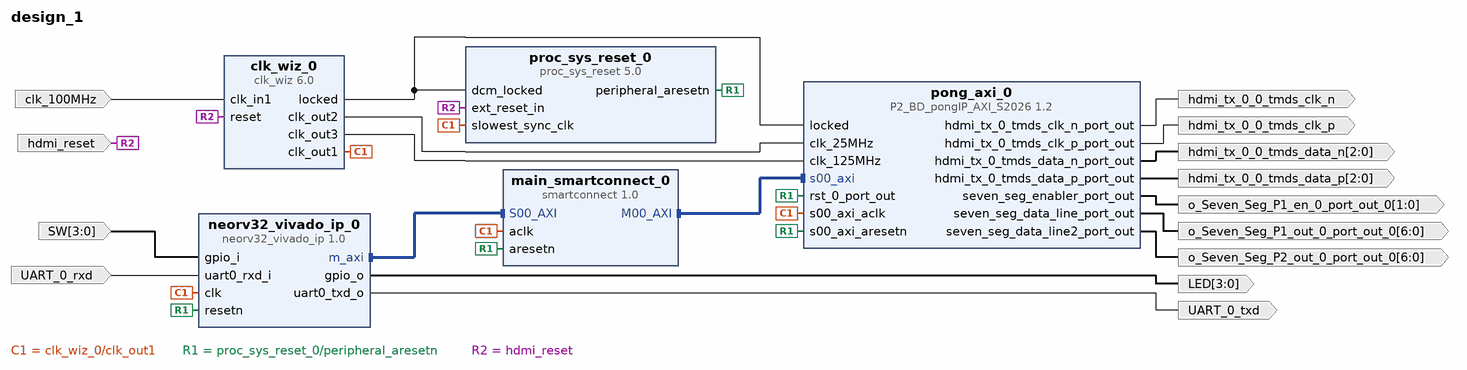
[diagram p0: block diagram of the top level]
# Vivado block design design_1, xc7s50csga324-1, Vivado 2025.1
create_bd_design design_1

create_bd_port -dir I -type clk clk_100MHz
set_property -dict {CONFIG.FREQ_HZ 100000000} [get_bd_ports clk_100MHz]
create_bd_port -dir I -type rst hdmi_reset
set_property -dict {CONFIG.POLARITY ACTIVE_HIGH} [get_bd_ports hdmi_reset]
create_bd_port -dir I UART_0_rxd
create_bd_port -dir O -type data UART_0_txd
create_bd_port -dir I -from 3 -to 0 SW
create_bd_port -dir O -from 3 -to 0 LED
create_bd_port -dir O -from 1 -to 0 o_Seven_Seg_P1_en_0_port_out_0
create_bd_port -dir O -from 6 -to 0 o_Seven_Seg_P1_out_0_port_out_0
create_bd_port -dir O -from 6 -to 0 -type data o_Seven_Seg_P2_out_0_port_out_0
create_bd_port -dir O -from 2 -to 0 -type data hdmi_tx_0_0_tmds_data_p
create_bd_port -dir O -from 2 -to 0 -type data hdmi_tx_0_0_tmds_data_n
create_bd_port -dir O -type clk hdmi_tx_0_0_tmds_clk_p
create_bd_port -dir O -type clk hdmi_tx_0_0_tmds_clk_n

create_bd_cell -type ip -vlnv xilinx.com:ip:clk_wiz:6.0 clk_wiz_0
set_property -dict [list \
  CONFIG.CLKOUT1_JITTER 130.958 \
  CONFIG.CLKOUT1_PHASE_ERROR 98.575 \
  CONFIG.CLKOUT1_REQUESTED_OUT_FREQ 100.000 \
  CONFIG.CLKOUT2_JITTER 175.402 \
  CONFIG.CLKOUT2_PHASE_ERROR 98.575 \
  CONFIG.CLKOUT2_REQUESTED_OUT_FREQ 25.000 \
  CONFIG.CLKOUT2_USED true \
  CONFIG.CLKOUT3_JITTER 125.247 \
  CONFIG.CLKOUT3_PHASE_ERROR 98.575 \
  CONFIG.CLKOUT3_REQUESTED_OUT_FREQ 125.000 \
  CONFIG.CLKOUT3_USED true \
  CONFIG.MMCM_CLKFBOUT_MULT_F 10.000 \
  CONFIG.MMCM_CLKOUT0_DIVIDE_F 10.000 \
  CONFIG.MMCM_CLKOUT1_DIVIDE 40 \
  CONFIG.MMCM_CLKOUT2_DIVIDE 8 \
  CONFIG.NUM_OUT_CLKS 3 \
] [get_bd_cells clk_wiz_0]
create_bd_cell -type ip -vlnv xilinx.com:ip:proc_sys_reset:5.0 proc_sys_reset_0
create_bd_cell -type ip -vlnv xilinx.com:ip:smartconnect:1.0 main_smartconnect_0
create_bd_cell -type ip -vlnv NEORV32:user:neorv32_vivado_ip:1.0 neorv32_vivado_ip_0
set_property -dict [list \
  CONFIG.BOOT_MODE_SELECT 2 \
  CONFIG.DMEM_EN true \
  CONFIG.IMEM_EN true \
  CONFIG.IO_GPIO_EN true \
  CONFIG.IO_GPIO_IN_NUM 4 \
  CONFIG.IO_GPIO_OUT_NUM 4 \
  CONFIG.IO_UART0_EN true \
  CONFIG.XBUS_EN true \
] [get_bd_cells neorv32_vivado_ip_0]
create_bd_cell -type ip -vlnv xilinx.com:user:P2_BD_pongIP_AXI_S2026:1.2 pong_axi_0

# ---- connections ----

connect_bd_intf_net [get_bd_intf_pins main_smartconnect_0/M00_AXI] [get_bd_intf_pins pong_axi_0/s00_axi]
connect_bd_intf_net [get_bd_intf_pins neorv32_vivado_ip_0/m_axi] [get_bd_intf_pins main_smartconnect_0/S00_AXI]
connect_bd_net [get_bd_ports clk_100MHz] [get_bd_pins clk_wiz_0/clk_in1]
connect_bd_net [get_bd_pins clk_wiz_0/clk_out1] \
  [get_bd_pins proc_sys_reset_0/slowest_sync_clk] [get_bd_pins main_smartconnect_0/aclk] \
  [get_bd_pins pong_axi_0/s00_axi_aclk] [get_bd_pins neorv32_vivado_ip_0/clk]
connect_bd_net [get_bd_pins clk_wiz_0/clk_out2] [get_bd_pins pong_axi_0/clk_25MHz]
connect_bd_net [get_bd_pins clk_wiz_0/clk_out3] [get_bd_pins pong_axi_0/clk_125MHz]
connect_bd_net [get_bd_pins clk_wiz_0/locked] [get_bd_pins proc_sys_reset_0/dcm_locked] [get_bd_pins pong_axi_0/locked]
connect_bd_net -net gpio_io_i_0_1 [get_bd_ports SW] [get_bd_pins neorv32_vivado_ip_0/gpio_i]
connect_bd_net [get_bd_pins neorv32_vivado_ip_0/gpio_o] [get_bd_ports LED]
connect_bd_net [get_bd_pins neorv32_vivado_ip_0/uart0_txd_o] [get_bd_ports UART_0_txd]
connect_bd_net [get_bd_pins pong_axi_0/hdmi_tx_0_tmds_clk_n_port_out] [get_bd_ports hdmi_tx_0_0_tmds_clk_n]
connect_bd_net [get_bd_pins pong_axi_0/hdmi_tx_0_tmds_clk_p_port_out] [get_bd_ports hdmi_tx_0_0_tmds_clk_p]
connect_bd_net [get_bd_pins pong_axi_0/hdmi_tx_0_tmds_data_n_port_out] [get_bd_ports hdmi_tx_0_0_tmds_data_n]
connect_bd_net [get_bd_pins pong_axi_0/hdmi_tx_0_tmds_data_p_port_out] [get_bd_ports hdmi_tx_0_0_tmds_data_p]
connect_bd_net [get_bd_pins pong_axi_0/seven_seg_data_line2_port_out] [get_bd_ports o_Seven_Seg_P2_out_0_port_out_0]
connect_bd_net [get_bd_pins pong_axi_0/seven_seg_data_line_port_out] [get_bd_ports o_Seven_Seg_P1_out_0_port_out_0]
connect_bd_net [get_bd_pins pong_axi_0/seven_seg_enabler_port_out] [get_bd_ports o_Seven_Seg_P1_en_0_port_out_0]
connect_bd_net [get_bd_pins proc_sys_reset_0/peripheral_aresetn] \
  [get_bd_pins main_smartconnect_0/aresetn] [get_bd_pins pong_axi_0/rst_0_port_out] [get_bd_pins pong_axi_0/s00_axi_aresetn] \
  [get_bd_pins neorv32_vivado_ip_0/resetn]
connect_bd_net -net reset_rtl_0_1 [get_bd_ports hdmi_reset] [get_bd_pins clk_wiz_0/reset] [get_bd_pins proc_sys_reset_0/ext_reset_in]
connect_bd_net -net uart0_rxd_i_0_1 [get_bd_ports UART_0_rxd] [get_bd_pins neorv32_vivado_ip_0/uart0_rxd_i]

# ---- address map ----
assign_bd_address -offset 0x40000000 -range 64K -target_address_space [get_bd_addr_spaces neorv32_vivado_ip_0/m_axi] [get_bd_addr_segs pong_axi_0/s00_axi/reg0]

validate_bd_design
save_bd_design
